# EAGLE design HeadAmp1 (EAGLE 6.4)
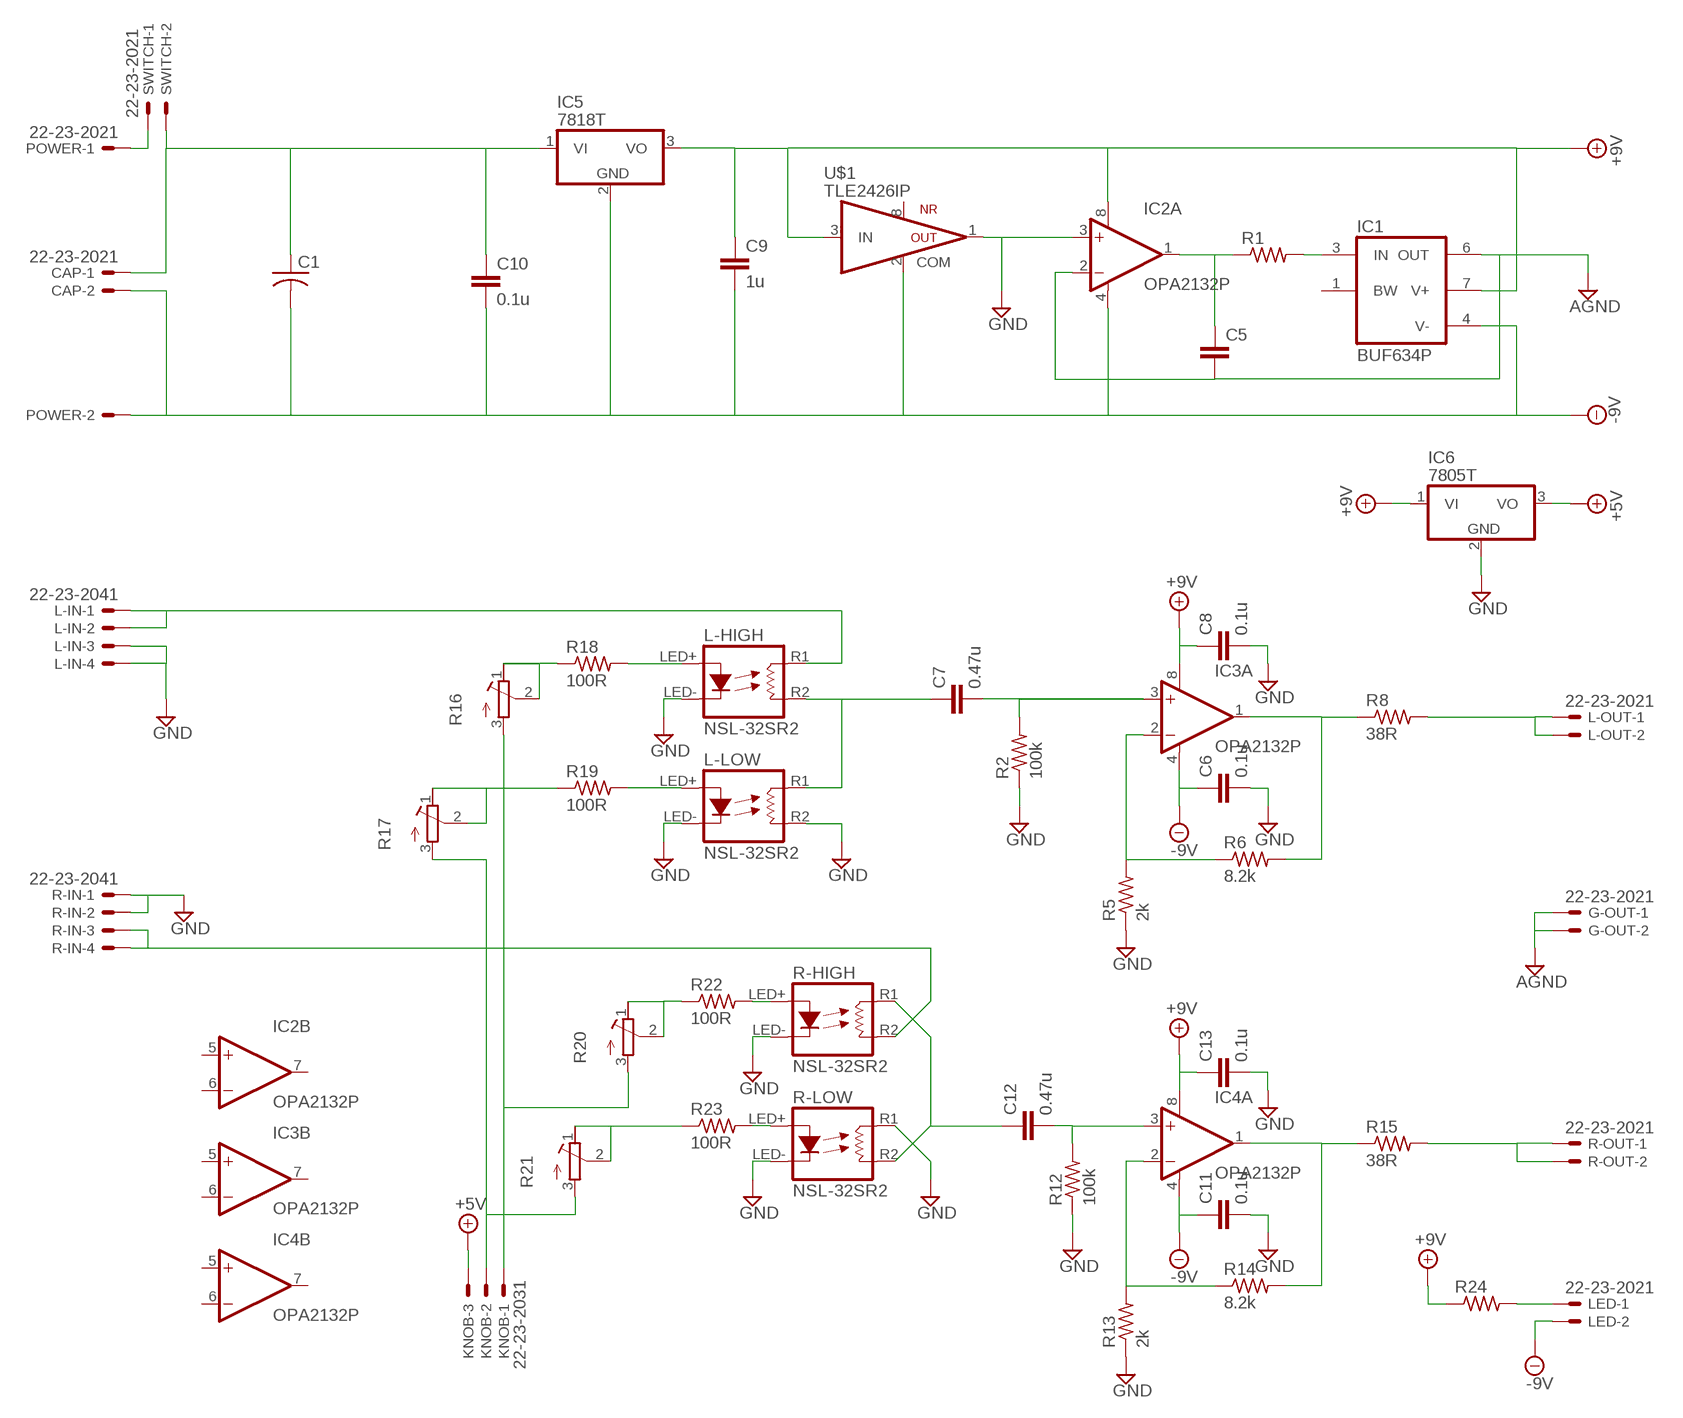
[diagram p0: schematic, sheet 1]

## Parts
C1  C-US050-075X075  [C050-075X075]
C5  C5/3  [C5B3]
C6  0.1u  C5/3  [C5B3]
C7  0.47u  C5/3  [C5B3]
C8  0.1u  C5/3  [C5B3]
C9  1u  C5/3  [C5B3]
C10  0.1u  C5/3  [C5B3]
C11  0.1u  C5/3  [C5B3]
C12  0.47u  C5/3  [C5B3]
C13  0.1u  C5/3  [C5B3]
CAP  22-23-2021  [22-23-2021]
G-OUT  22-23-2021  [22-23-2021]
IC1  BUF634P  [DIL08]
IC2  OPA2132P  [DIL08]
IC3  OPA2132P  [DIL08]
IC4  OPA2132P  [DIL08]
IC5  7818T  [TO220H]
IC6  7805T  [TO220H]
KNOB  22-23-2031  [22-23-2031]
L-HIGH  NSL-32SR2  [OPTO_32SR]
L-IN  22-23-2041  [22-23-2041]
L-LOW  NSL-32SR2  [OPTO_32SR]
L-OUT  22-23-2021  [22-23-2021]
LED  22-23-2021  [22-23-2021]
POWER  22-23-2021  [22-23-2021]
R1  R-US_0207/10  [0207/10]
R2  100k  R-US_0207/10  [0207/10]
R5  2k  R-US_0207/10  [0207/10]
R6  8.2k  R-US_0207/10  [0207/10]
R8  38R  R-US_0207/10  [0207/10]
R12  100k  R-US_0207/10  [0207/10]
R13  2k  R-US_0207/10  [0207/10]
R14  8.2k  R-US_0207/10  [0207/10]
R15  38R  R-US_0207/10  [0207/10]
R16  R-TRIMMT93YB  [RTRIMT93YB]
R17  R-TRIMMT93YB  [RTRIMT93YB]
R18  100R  R-US_0207/10  [0207/10]
R19  100R  R-US_0207/10  [0207/10]
R20  R-TRIMMT93YB  [RTRIMT93YB]
R21  R-TRIMMT93YB  [RTRIMT93YB]
R22  100R  R-US_0207/10  [0207/10]
R23  100R  R-US_0207/10  [0207/10]
R24  R-US_0207/10  [0207/10]
R-HIGH  NSL-32SR2  [OPTO_32SR]
R-IN  22-23-2041  [22-23-2041]
R-LOW  NSL-32SR2  [OPTO_32SR]
R-OUT  22-23-2021  [22-23-2021]
SWITCH  22-23-2021  [22-23-2021]
U$1  TLE2426IP  [DIL08]

## Nets
+5V: IC6.3(VO) KNOB.3
+9V [Power]: C8.1 C9.1 C13.1 IC1.7(V+) IC2.8(A:V+) IC3.8(A:V+) IC4.8(A:V+) IC5.3(VO) IC6.1(VI) R24.1 U$1.3(IN)
-9V [Power]: C1.2 C6.1 C9.2 C10.2 C11.1 CAP.2 IC1.4(V-) IC2.4(A:V-) IC3.4(A:V-) IC4.4(A:V-) IC5.2(GND) LED.2 POWER.2 U$1.2(COMMON)
AGND [AGND]: C5.2 G-OUT.1 G-OUT.2 IC1.6(OUT) IC2.2(A:-IN)
GND [Power]: C6.2 C8.2 C11.2 C13.2 IC2.3(A:+IN) IC6.2(GND) L-HIGH.LED-(C) L-IN.3 L-IN.4 L-LOW.LED-(C) L-LOW.R2(L2) R2.1 R5.1 R12.1 R13.1 R-HIGH.LED-(C) R-IN.1 R-IN.2 R-LOW.LED-(C) R-LOW.R1(L1) U$1.1(OUT)
N$1: IC3.2(A:-IN) R5.2 R6.1
N$2 [Raudio]: IC3.1(A:OUT) R6.2 R8.1
N$3 [Raudio]: C7.2 IC3.3(A:+IN) R2.2
N$5: C5.1 IC2.1(A:OUT) R1.1
N$6: IC1.3(IN) R1.2
N$7: IC4.2(A:-IN) R13.2 R14.1
N$8 [Raudio]: L-OUT.1 L-OUT.2 R8.2
N$9 [Raudio]: IC4.1(A:OUT) R14.2 R15.1
N$10 [Raudio]: C12.2 IC4.3(A:+IN) R12.2
N$11 [Power]: C1.1 C10.1 CAP.1 IC5.1(VI) SWITCH.2
N$12 [Raudio]: R15.2 R-OUT.1 R-OUT.2
N$13 [Raudio]: L-HIGH.R1(L1) L-IN.1 L-IN.2
N$14 [Raudio]: C7.1 L-HIGH.R2(L2) L-LOW.R1(L1)
N$15: R16.1(A) R16.2(S) R18.1
N$16: R17.1(A) R17.2(S) R19.1
N$17: KNOB.1 R16.3(E) R20.3(E)
N$18: KNOB.2 R17.3(E) R21.3(E)
N$19: L-HIGH.LED+(A) R18.2
N$20: L-LOW.LED+(A) R19.2
N$21 [Raudio]: R-HIGH.R2(L2) R-IN.3 R-IN.4
N$22 [Raudio]: C12.1 R-HIGH.R1(L1) R-LOW.R2(L2)
N$23: R20.1(A) R20.2(S) R22.1
N$24: R21.1(A) R21.2(S) R23.1
N$25 [Power]: POWER.1 SWITCH.1
N$26: LED.1 R24.2
N$27: R22.2 R-HIGH.LED+(A)
N$28: R23.2 R-LOW.LED+(A)
Unconnected: IC1.1(BW) IC2.5(B:+IN) IC2.6(B:-IN) IC2.7(B:OUT) IC3.5(B:+IN) IC3.6(B:-IN) IC3.7(B:OUT) IC4.5(B:+IN) IC4.6(B:-IN) IC4.7(B:OUT) U$1.8(NR)

## Library data of the parts
C1 = resistor:C-US: CAPACITOR, American symbol
C5-C13 = capacitor-wima:C: CAPACITOR naming: grid - package width
CAP G-OUT L-OUT LED POWER R-OUT SWITCH = con-molex:22-23-2021: .100" (2.54mm) Center Header - 2 Pin; MF: MOLEX; MPN: 22-23-2021; OC_FARNELL: 1462926; OC_NEWARK: 25C3832
IC1 = burr-brown:BUF634: 250mA High-Speed Buffer; MF: TEXAS INSTRUMENTS; MPN: BUF634P; OC_FARNELL: 1470343; OC_NEWARK: 80K5714
IC2-IC4 = burr-brown:OPA2132: High Speed FET-Input Operational Amplifiers< Product Folder:OPA2132; MPN: OPA2132P; OC_FARNELL: 1212432; OC_NEWARK: 47P7461
IC5 IC6 = linear:78*: Positive VOLTAGE REGULATOR Source: http://cache.national.com/ds/LM/LM78L05.pdf http://www.fairchildsemi.com/ds/LM/LM7805.pdf
KNOB = con-molex:22-23-2031: .100" (2.54mm) Center Header - 3 Pin; MF: MOLEX; MPN: 22-23-2031; OC_FARNELL: 1462950; OC_NEWARK: 30C0862
L-HIGH L-LOW R-HIGH R-LOW = Audio:NSL-32SR2
L-IN R-IN = con-molex:22-23-2041: .100" (2.54mm) Center Header - 4 Pin; MF: MOLEX; MPN: 22-23-2041; OC_FARNELL: 1462920; OC_NEWARK: 38C0355
R1 R2 R5 R6 R8 R12-R15 R18 R19 R22-R24 = resistor:R-US_: RESISTOR, American symbol
R16 R17 R20 R21 = resistor:R-TRIMM: Trimm resistor
U$1 = Audio:TLE2426IP

## Net classes
0 default: width 0.254 mm, clearance 0.254 mm
1 Raudio: width 2.54 mm, clearance 0.254 mm to class 0, clearance 0.254 mm
2 AGND: width 2.54 mm, clearance 0.254 mm to class 0, clearance 2.54 mm to class 1, clearance 0.254 mm
3 Laudio: width 2.54 mm, clearance 0.254 mm to class 0, clearance 5.08 mm to class 1, clearance 2.54 mm to class 2, clearance 0.254 mm
4 Power: width 1.27 mm, clearance 0.254 mm to class 0, clearance 0.254 mm to class 1, clearance 0.254 mm to class 2, clearance 0.254 mm to class 3, clearance 0.254 mm

## Board
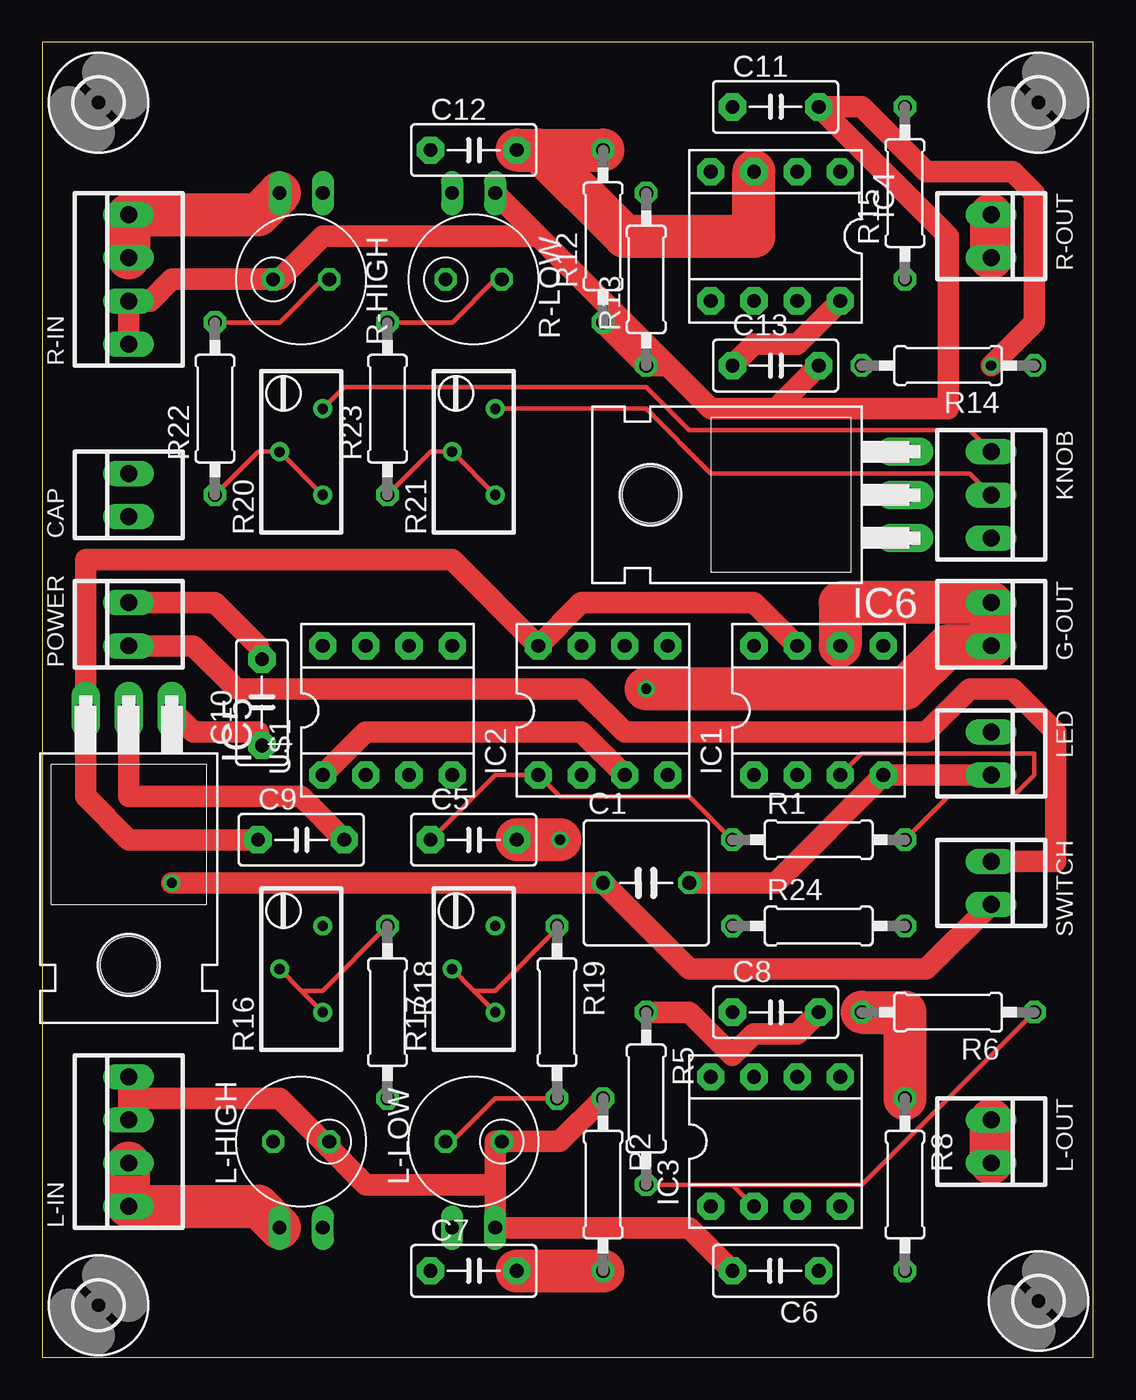
[diagram p1: board, top side]
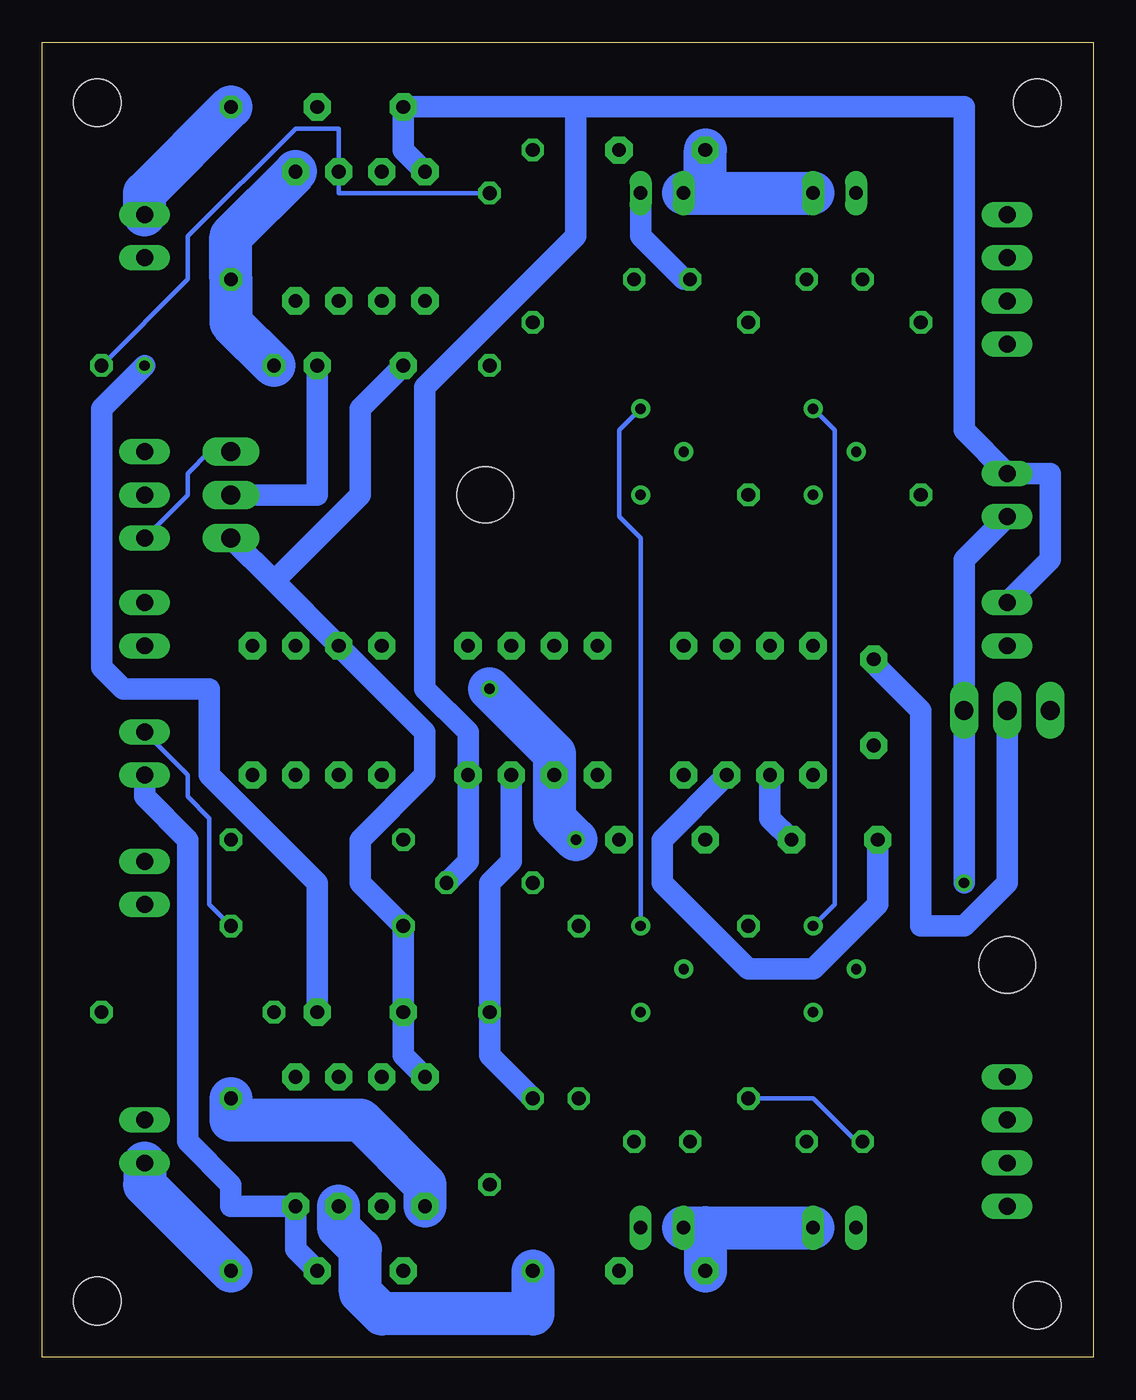
[diagram p2: board, bottom side, seen from below]

Size 61.9 x 77.46 mm. Coordinates in mm from the lower left corner, seen from the top.
Outline: 0,0 61.9,0 61.9,77.46 0,77.46 0,0
Copper layers (1*16): Top 0.035mm / dielectric 1.5mm / Bottom 0.035mm
Design rules "default": minimum track width 10mil, minimum drill 24mil, track to track 8mil, track to pad 8mil, pad to pad 8mil, via to via 8mil, smd to smd 8mil, copper to edge 40mil, drill to drill 8mil, minimum pad ring 10mil, minimum via ring 8mil, stop-mask expansion 4mil, vias tented up to drill 0mil, thermal gap 10mil

### Footprints (pad centres in the part's own frame; a part is rotated, then mirrored left to right if it is on the bottom)
C050-075X075 = drill 0.813 octagon: 1 -2.54,0; 2 2.54,0
C5B3 = drill 0.813 pad 1.6 octagon: 1 -2.54,0; 2 2.54,0
22-23-2021 = drill 1 long: 1 -1.27,0; 2 1.27,0
DIL08 = drill 0.813 pad 1.6 octagon: 1 -3.81,-3.81; 2 -1.27,-3.81; 3 1.27,-3.81; 4 3.81,-3.81; 5 3.81,3.81; 6 1.27,3.81; 7 -1.27,3.81; 8 -3.81,3.81
TO220H = drill 1.118 long: 1 -2.54,-10.16; 2 0,-10.16; 3 2.54,-10.16 | hole 3.302: 0,4.826
22-23-2031 = drill 1 long: 1 -2.54,0; 2 0,0; 3 2.54,0
OPTO_32SR = drill 0.8 octagon: LED+ 0,1.651; LED- 0,-1.651 | drill 0.8 long: R1 -5.08,1.27; R2 -5.08,-1.27
22-23-2041 = drill 1 long: 1 -3.81,0; 2 -1.27,0; 3 1.27,0; 4 3.81,0
0207/10 = drill 0.813 octagon: 1 -5.08,0; 2 5.08,0
RTRIMT93YB = drill 0.61: 1 1.27,-2.54; 2 -1.27,0; 3 1.27,2.54
2,8 = hole 2.8: 0,0

### Placement (x,y rotation side)
C1  35.56,27.94 0 top
C5  25.4,30.48 0 top
C6  43.18,5.08 180 top
C7  25.4,5.08 0 top
C8  43.18,20.32 0 top
C9  15.24,30.48 0 top
C10  12.93,38.58 90 top
C11  43.18,73.66 0 top
C12  25.4,71.12 0 top
C13  43.18,58.42 0 top
CAP  5.08,50.8 90 top
G-OUT  55.88,43.18 270 top
IC1  45.72,38.1 0 top
IC2  33.02,38.1 0 top
IC3  43.18,12.7 0 top
IC4  43.18,66.04 180 top
IC5  5.08,27.94 180 top
IC6  40.64,50.8 90 top
KNOB  55.88,50.8 270 top
L-HIGH  15.24,12.7 90 top
L-IN  5.08,12.7 90 top
L-LOW  25.4,12.7 90 top
L-OUT  55.88,12.7 270 top
LED  55.88,35.56 270 top
POWER  5.08,43.18 90 top
R1  45.72,30.48 0 top
R2  33.02,10.16 270 top
R5  35.56,15.24 270 top
R6  53.34,20.32 180 top
R8  50.8,10.16 270 top
R12  33.02,66.04 90 top
R13  35.56,63.5 90 top
R14  53.34,58.42 180 top
R15  50.8,68.58 90 top
R16  15.24,22.86 0 top
R17  25.4,22.86 0 top
R18  20.32,20.32 270 top
R19  30.31,20.32 270 top
R20  15.24,53.34 0 top
R21  25.4,53.34 0 top
R22  10.16,55.88 90 top
R23  20.32,55.88 90 top
R24  45.72,25.4 0 top
R-HIGH  15.24,63.5 270 top
R-IN  5.08,63.5 90 top
R-LOW  25.4,63.5 270 top
R-OUT  55.88,66.04 270 top
SWITCH  55.88,27.94 270 top
U$1  20.32,38.1 0 top
U$2  [2,8]  3.3,3.05 0 top
U$3  [2,8]  58.67,3.3 0 top
U$4  [2,8]  3.3,73.91 0 top
U$5  [2,8]  58.67,73.91 0 top

### Tracks (layer width: path | path; a pad name or v marks a point on that pad's centre or on a via)
+5V
  Bottom 0.254: KNOB.3 53.34,50.8 53.34,52.07 52.07,53.34 IC6.3
+9V
  Top 1.27: C9.1 5.08,30.48 2.54,33.02 IC5.3 2.54,46.99 24.13,46.99 IC2.8 31.75,44.45 41.91,44.45 IC1.7 | C13.1 41.91,59.69 44.45,59.69 IC4.8
  Bottom 1.27: U$1.3 25.4,30.48 25.4,27.94 20.32,22.86 16.51,22.86 12.7,26.67 C9.1 | IC3.8 40.64,17.78 C8.1 R24.1 43.18,27.94 43.18,30.48 39.37,34.29 39.37,36.83 IC1.7 48.26,45.72 | 48.26,45.72 IC6.1 | C13.1 43.18,55.88 43.18,50.8 48.26,45.72
-9V
  Top 1.27: LED.2 IC1.4 43.18,27.94 C1.2 | IC5.2 5.08,33.02 15.24,33.02 C9.2 | POWER.2 10.16,44.45 12.7,41.91 C10.2
  Bottom 1.27: C1.2 36.83,29.21 IC2.4 36.83,36.83 39.37,39.37 39.37,57.15 30.48,66.04 30.48,73.66 | C6.1 46.99,6.35 IC3.4 50.8,8.89 50.8,10.16 53.34,12.7 53.34,30.48 55.88,33.02 LED.2 | C9.2 19.05,31.75 U$1.2 | IC4.4 40.64,71.12 C11.1 30.48,73.66 | POWER.2 2.54,46.99 2.54,52.07 CAP.2 7.62,54.61 7.62,73.66 30.48,73.66 | IC5.2 5.08,27.94 7.62,25.4 10.16,25.4 10.16,38.1 12.7,40.64 C10.2
AGND  (via drill 0.61)
  Top 2.54: v30.48,30.48 C5.2 | IC1.6 46.99,44.45 G-OUT.1 G-OUT.2 53.34,41.91 50.8,39.37 v35.56,39.37
  Bottom 2.54: v30.48,30.48 31.75,31.75 IC2.2 31.75,35.56 v35.56,39.37
GND  (via drill 0.61)
  Top 1.27: R-IN.1 R-IN.2 6.35,62.23 7.62,63.5 R-HIGH.LED- 13.97,63.5 16.51,66.04 29.21,66.04 | R12.1 R13.1 36.83,58.42 | 43.18,55.88 C13.2 | 43.18,55.88 39.37,55.88 36.83,58.42 | 43.18,55.88 53.34,55.88 53.34,66.04 C11.2 48.26,73.66 52.07,69.85 57.15,69.85 58.42,68.58 58.42,60.96 v55.88,58.42 | 36.83,58.42 29.21,66.04 | 29.21,66.04 R-LOW.R1 | U$1.1 19.05,36.83 31.75,36.83 IC2.3 | C8.2 44.45,19.05 41.91,19.05 40.64,17.78 38.1,20.32 R5.1 | L-IN.4 5.08,15.24 | 5.08,15.24 L-IN.3 | 26.67,10.16 26.67,12.7 L-LOW.LED- 30.48,12.7 R2.1 | 26.67,10.16 L-LOW.R2 38.1,7.62 C6.2 | 16.51,12.7 19.05,10.16 26.67,10.16 | 5.08,15.24 13.97,15.24 16.51,12.7 | 16.51,12.7 L-HIGH.LED-
  Bottom 1.27: R-LOW.R1 26.67,66.04 24.13,63.5 R-LOW.LED- | IC6.2 45.72,50.8 C13.2 | R2.1 35.56,17.78 R5.1 35.56,27.94 34.29,29.21 IC2.3 | v55.88,58.42 58.42,55.88 58.42,40.64 57.15,39.37 52.07,39.37 52.07,34.29 45.72,27.94 C8.2
N$1
  Top 0.254: 40.64,10.16 R5.2 | IC3.2 40.64,10.16 | R6.1 48.26,10.16 40.64,10.16
N$2
  Top 2.54: R8.1 50.8,20.32 R6.2
  Bottom 2.54: IC3.1 39.37,10.16 43.18,13.97 50.8,13.97 R8.1
N$3
  Top 2.54: C7.2 R2.2
  Bottom 2.54: IC3.3 44.45,7.62 43.18,6.35 43.18,3.81 41.91,2.54 33.02,2.54 R2.2
N$5
  Top 0.254: R1.1 38.1,33.02 30.48,33.02 IC2.1 26.67,34.29 C5.1
N$6
  Top 0.254: R1.2 53.34,33.02 57.15,33.02 58.42,34.29 58.42,35.56 48.26,35.56 IC1.3
N$7
  Bottom 0.254: R13.2 44.45,68.58 IC4.2 44.45,72.39 46.99,72.39 53.34,66.04 53.34,63.5 R14.1
N$8
  Top 2.54: L-OUT.2 L-OUT.1
  Bottom 2.54: R8.2 55.88,10.16 L-OUT.2
N$9
  Bottom 2.54: R14.2 50.8,60.96 R15.1 50.8,66.04 IC4.1
N$10
  Top 2.54: C12.2 29.21,71.12 | 29.21,71.12 R12.2 | IC4.3 41.91,66.04 34.29,66.04 29.21,71.12
N$11  (via drill 0.61)
  Top 1.27: IC5.1 8.89,36.83 12.7,36.83 C10.1 | SWITCH.2 52.07,22.86 38.1,22.86 C1.1 v7.62,27.94
  Bottom 1.27: CAP.1 7.62,46.99 IC5.1 v7.62,27.94
N$12
  Top 2.54: R-OUT.1 R-OUT.2
  Bottom 2.54: R15.2 55.88,68.58 R-OUT.1
N$13
  Top 2.54: L-HIGH.R1 12.7,8.89 L-IN.1 L-IN.2
N$14
  Bottom 2.54: L-LOW.R1 22.86,7.62 | 22.86,7.62 L-HIGH.R2 | 22.86,7.62 C7.1
N$15
  Top 0.254: R16.1 15.24,21.59 | 15.24,21.59 R16.2 | R18.1 16.51,21.59 15.24,21.59
N$16
  Top 0.254: R17.1 25.4,21.59 | 25.4,21.59 R17.2 | 25.4,21.59 26.67,21.59 30.48,25.4 R19.1
N$17
  Top 0.254: KNOB.1 54.61,54.61 38.1,54.61 35.56,57.15 17.78,57.15 R20.3
  Bottom 0.254: R16.3 15.24,26.67 15.24,54.61 R20.3
N$18
  Top 0.254: KNOB.2 54.61,52.07 39.37,52.07 35.56,55.88 R21.3
  Bottom 0.254: R17.3 26.67,48.26 27.94,49.53 27.94,54.61 R21.3
N$19
  Bottom 0.254: R18.2 16.51,15.24 13.97,12.7 L-HIGH.LED+
N$20
  Top 0.254: L-LOW.LED+ 24.13,12.7 26.67,15.24 R19.2 30.48,15.24
N$21
  Top 2.54: R-HIGH.R2 12.7,67.31 R-IN.4 R-IN.3
N$22
  Bottom 2.54: R-LOW.R2 22.86,68.58 | 22.86,68.58 R-HIGH.R1 | 22.86,68.58 C12.1
N$23
  Top 0.254: R20.1 R20.2 12.7,53.34 R22.1
N$24
  Top 0.254: R21.1 R21.2 22.86,53.34 R23.1
N$25
  Top 1.27: POWER.1 8.89,41.91 11.43,39.37 31.75,39.37 34.29,36.83 52.07,36.83 54.61,39.37 57.15,39.37 59.69,36.83 59.69,29.21 SWITCH.1
N$26
  Bottom 0.254: R24.2 52.07,26.67 52.07,31.75 53.34,33.02 53.34,34.29 LED.1
N$27
  Top 0.254: R22.2 13.97,60.96 16.51,63.5 R-HIGH.LED+
N$28
  Top 0.254: R23.2 24.13,60.96 26.67,63.5 R-LOW.LED+